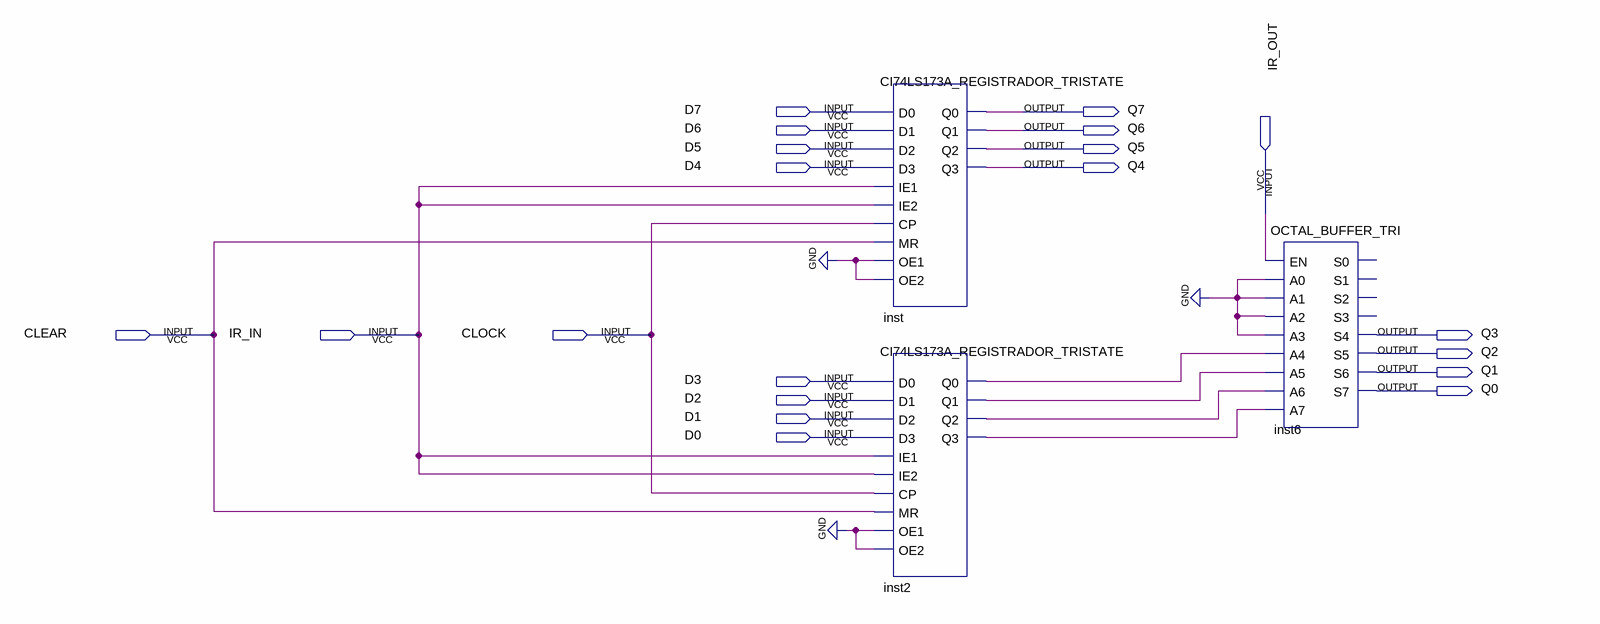
[diagram p0: schematic sheet]
// Quartus schematic Registrador_de_Instrucoes.bdf as structural Verilog: 3 symbols, 20 pins
module Registrador_de_Instrucoes (
  input  D7,
  input  D6,
  input  D5,
  input  D4,
  input  IR_OUT,
  input  CLEAR,
  input  IR_IN,
  input  CLOCK,
  input  D3,
  input  D2,
  input  D1,
  input  D0,
  output Q7,
  output Q6,
  output Q5,
  output Q4,
  output Q3,
  output Q2,
  output Q1,
  output Q0
);

  wire inst2_q0, inst2_q1, inst2_q2, inst2_q3;

  CI74LS173A_REGISTRADOR_TRISTATE inst (
    .D0(D7), .D1(D6), .D2(D5), .D3(D4), .IE1(IR_IN), .IE2(IR_IN), .CP(CLOCK), .MR(CLEAR), .OE1(1'b0),
    .OE2(1'b0), .Q2(Q5), .Q1(Q6), .Q3(Q4), .Q0(Q7));
  CI74LS173A_REGISTRADOR_TRISTATE inst2 (
    .D0(D3), .D1(D2), .D2(D1), .D3(D0), .IE1(IR_IN), .IE2(IR_IN), .CP(CLOCK), .MR(CLEAR), .OE1(1'b0),
    .OE2(1'b0), .Q2(inst2_q2), .Q1(inst2_q1), .Q3(inst2_q3), .Q0(inst2_q0));
  OCTAL_BUFFER_TRI inst6 (
    .EN(IR_OUT), .A0(1'b0), .A1(1'b0), .A2(1'b0), .A3(1'b0), .A4(inst2_q0), .A5(inst2_q1), .A6(inst2_q2),
    .A7(inst2_q3), .S4(Q3), .S5(Q2), .S6(Q1), .S7(Q0));  // open: S0, S1, S2, S3
endmodule
